# EAGLE design LB_BIT_i25_mp3Player-v03(3_3)OHW (EAGLE 6.6.0)

## Sheet 1 of 2: Main
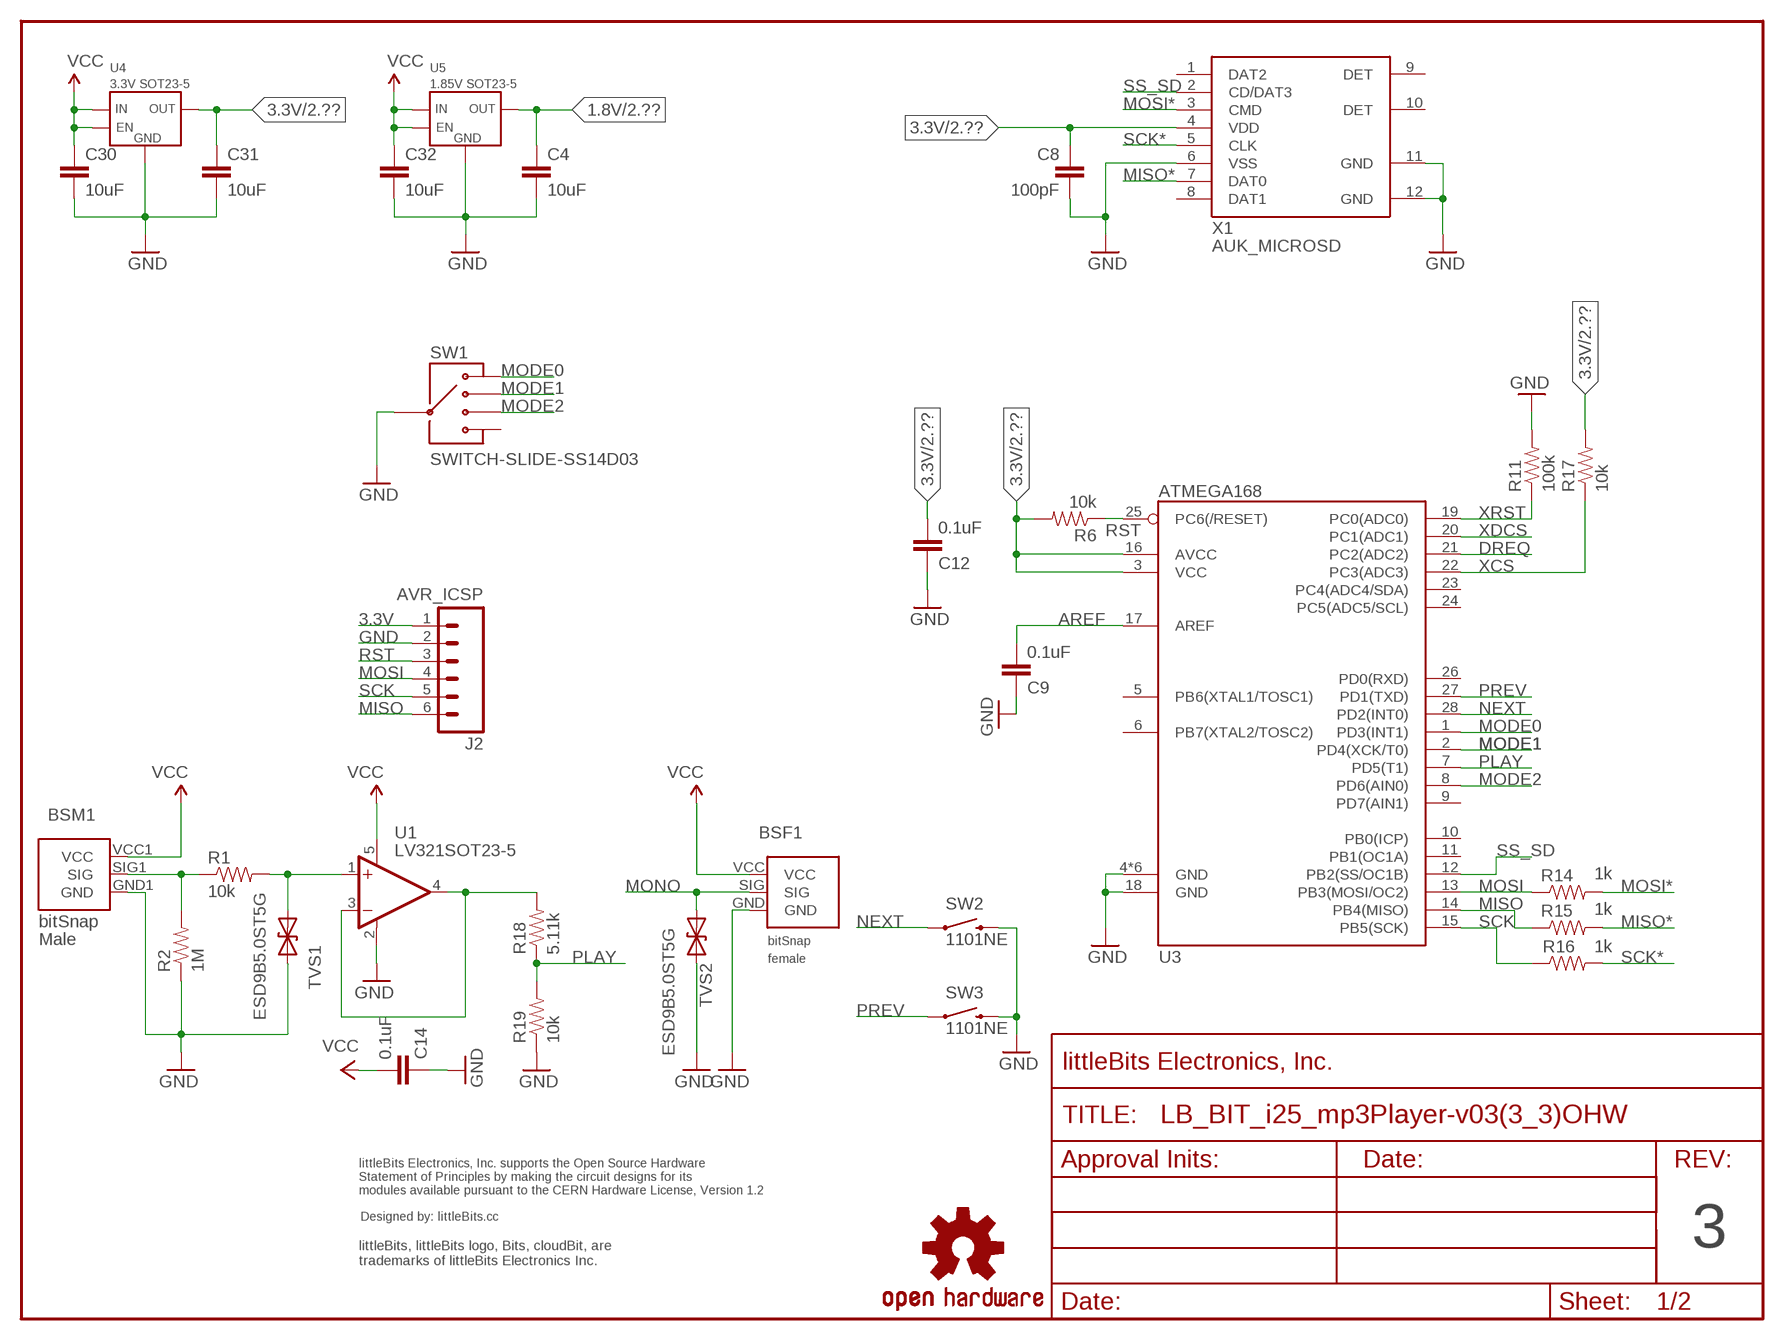
[diagram p0: schematic, sheet 1]

### Parts
BSF1  BITSNAP_V03_FEMALE  [BITSNAP_V03_FEMALE]
BSM1  BITSNAP_V03_MALE  [BITSNAP_V03_MALE]
C4  10uF  CAPCAP-0603  [CAP-0603]
C8  100pF  CAPCAP-0603  [CAP-0603]
C9  0.1uF  CAPCAP-0402  [CAP-0402]
C12  0.1uF  CAPCAP-0402  [CAP-0402]
C14  0.1uF  CAPCAP-0603  [CAP-0603]
C30  10uF  CAPCAP-0603  [CAP-0603]
C31  10uF  CAPCAP-0603  [CAP-0603]
C32  10uF  CAPCAP-0603  [CAP-0603]
J2  AVR_ICSP  HRD-60.1INCH_NO_SILKSCREEN_SMALL  [SIP6-SM-0.1IN-NOS.S-MIN]
R1  10k  RESISTOR0603  [RES-0603]
R2  1M  RESISTOR0603  [RES-0603]
R6  10k  RESISTOR0603  [RES-0603]
R11  100k  RESISTOR0603  [RES-0603]
R14  1k  RESISTOR0603  [RES-0603]
R15  1k  RESISTOR0603  [RES-0603]
R16  1k  RESISTOR0603  [RES-0603]
R17  10k  RESISTOR0603  [RES-0603]
R18  5.11k  RESISTOR0603  [RES-0603]
R19  10k  RESISTOR0603  [RES-0603]
SW1  SWITCH-SLIDE-SS14D03  [SWITCH-SLIDE-SP4T-SS14D03]
SW2  1101NE  SWITCH-MOMENTARY-2-SMD-1101NE  [TACTILE-SWITCH-1101NE]
SW3  1101NE  SWITCH-MOMENTARY-2-SMD-1101NE  [TACTILE-SWITCH-1101NE]
TVS1  ESD9B5.0ST5G  DIODE-TVSSOD-923  [SOD-923]
TVS2  ESD9B5.0ST5G  DIODE-TVSSOD-923  [SOD-923]
U1  LV321SOT23-5  [SOT23-5]
U3  ATMEGA168  ATMEGA168-28PINVFQFN-28  [VQFN28]
U4  3.3V SOT23-5  V_REG_SOT23-5_EN  [SOT23-5]
U5  1.85V SOT23-5  V_REG_SOT23-5_EN  [SOT23-5]
U$1  OSHWCREDIT  [OSHWCREDIT]
U$2  OSHW-LOGOL  [OSHW-LOGO-L]
U$38  FRAME-LETTER-OHWOHW  [FABDWG01-OHW]
X1  AUK_MICROSD  [AUK_TFC08WP01-R1K-H]

### Nets
1.8V: C4.1 U5.5(OUT) ; also sheet 2
3.3V: C8.1 C12.2 C31.1 J2.1 R6.2 R17.2 U3.3(VCC) U3.16(AVCC) U4.5(OUT) X1.4(VDD) ; also sheet 2
AREF: C9.2 U3.17(AREF)
DREQ: U3.21(PC2(ADC2)) ; also sheet 2
GND: BSF1.GND BSM1.GND1(GND) C4.2 C8.2 C9.1 C12.1 C14.1 C30.2 C31.2 C32.2 J2.2 R2.1 R11.2 R19.1 SW1.COM SW2.P$2 SW3.P$2 TVS1.2(C) TVS2.2(C) U1.2(V-) U3.4(GND) U3.18(GND) U3.TH(GND) U3.TH@1(GND) U3.TH@2(GND) U3.TH@3(GND) U3.TH@4(GND) U4.2(GND) U5.2(GND) X1.6(VSS) X1.11(GND) X1.12(GND) ; also sheet 2
MISO: J2.6 R15.1 U3.14(PB4(MISO))
MISO*: R15.2 X1.7(DAT0) ; also sheet 2
MODE0: SW1.1 U3.1(PD3(INT1))
MODE1: SW1.2 U3.2(PD4(XCK/T0))
MODE2: SW1.3 U3.8(PD6(AIN0))
MONO: BSF1.SIG TVS2.1(A) ; also sheet 2
MOSI: J2.4 R14.1 U3.13(PB3(MOSI/OC2))
MOSI*: R14.2 X1.3(CMD) ; also sheet 2
N$4: BSM1.SIG1(SIG) R1.1 R2.2
N$9: R1.2 TVS1.1(A) U1.1(+IN)
N$17: R18.2 U1.3(-IN) U1.4(OUT)
NEXT: SW2.P$1 U3.28(PD2(INT0))
PLAY: R18.1 R19.2 U3.7(PD5(T1))
PREV: SW3.P$1 U3.27(PD1(TXD))
RST: J2.3 R6.1 U3.25(PC6(/RESET))
SCK: J2.5 R16.1 U3.15(PB5(SCK))
SCK*: R16.2 X1.5(CLK) ; also sheet 2
SS_SD: U3.12(PB2(SS/OC1B)) X1.2(CD/DAT3)
VCC: BSF1.VCC BSM1.VCC1(VCC) C14.2 C30.1 C32.1 U1.5(V+) U4.1(IN) U4.3(EN) U5.1(IN) U5.3(EN) ; also sheet 2
XCS: R17.1 U3.22(PC3(ADC3)) ; also sheet 2
XDCS: U3.20(PC1(ADC1)) ; also sheet 2
XRST: R11.1 U3.19(PC0(ADC0)) ; also sheet 2
Unconnected: SW1.4 U3.5(PB6(XTAL1/TOSC1)) U3.6(PB7(XTAL2/TOSC2)) U3.9(PD7(AIN1)) U3.10(PB0(ICP)) U3.11(PB1(OC1A)) U3.23(PC4(ADC4/SDA)) U3.24(PC5(ADC5/SCL)) U3.26(PD0(RXD)) X1.1(DAT2) X1.8(DAT1) X1.9(DET) X1.10(DET)

### Notes on the sheet
- 3

## Sheet 2 of 2: Audio
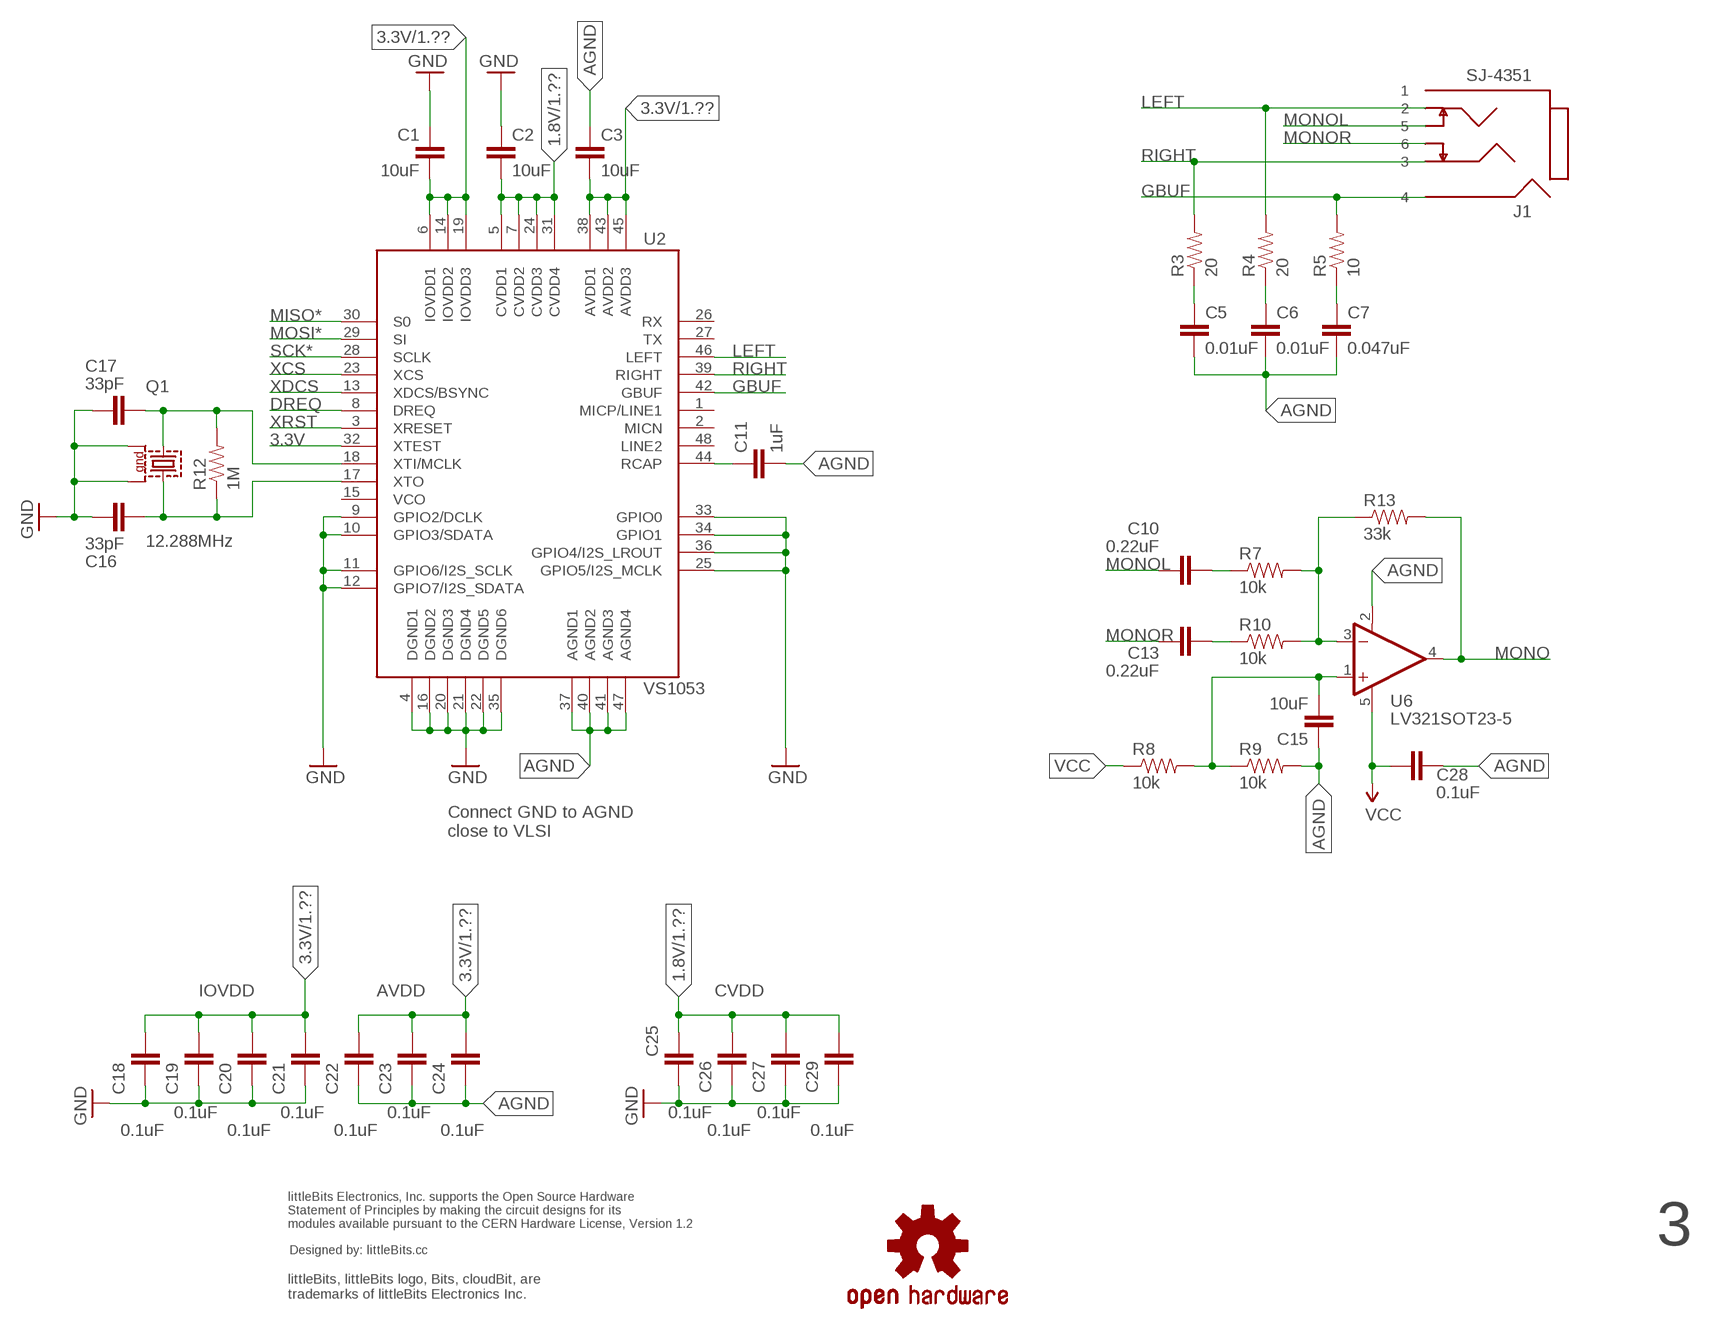
[diagram p1: schematic, sheet 2]

### Parts
C1  10uF  CAPCAP-0603  [CAP-0603]
C2  10uF  CAPCAP-0603  [CAP-0603]
C3  10uF  CAPCAP-0603  [CAP-0603]
C5  0.01uF  CAPCAP-0603  [CAP-0603]
C6  0.01uF  CAPCAP-0603  [CAP-0603]
C7  0.047uF  CAPCAP-0603  [CAP-0603]
C10  0.22uF  CAPCAP-0603  [CAP-0603]
C11  1uF  CAPCAP-0402  [CAP-0402]
C13  0.22uF  CAPCAP-0603  [CAP-0603]
C15  10uF  CAPCAP-0603  [CAP-0603]
C16  33pF  CAPCAP-0603  [CAP-0603]
C17  33pF  CAPCAP-0603  [CAP-0603]
C18  0.1uF  CAPCAP-0402  [CAP-0402]
C19  0.1uF  CAPCAP-0402  [CAP-0402]
C20  0.1uF  CAPCAP-0402  [CAP-0402]
C21  0.1uF  CAPCAP-0402  [CAP-0402]
C22  0.1uF  CAPCAP-0402  [CAP-0402]
C23  0.1uF  CAPCAP-0402  [CAP-0402]
C24  0.1uF  CAPCAP-0402  [CAP-0402]
C25  0.1uF  CAPCAP-0402  [CAP-0402]
C26  0.1uF  CAPCAP-0402  [CAP-0402]
C27  0.1uF  CAPCAP-0402  [CAP-0402]
C28  0.1uF  CAPCAP-0603  [CAP-0603]
C29  0.1uF  CAPCAP-0402  [CAP-0402]
J1  SJ-4351  JACK-PHONO-4COND-SW  [CUI-SJ-4351]
Q1  12.288MHz  CRYSTAL-SMD-7B-SERIES-TXC  [CRYSTAL-SMD-7B-SERIES-5X3.2MM]
R3  20  RESISTOR0603  [RES-0603]
R4  20  RESISTOR0603  [RES-0603]
R5  10  RESISTOR0603  [RES-0603]
R7  10k  RESISTOR0603  [RES-0603]
R8  10k  RESISTOR0603  [RES-0603]
R9  10k  RESISTOR0603  [RES-0603]
R10  10k  RESISTOR0603  [RES-0603]
R12  1M  RESISTOR0603  [RES-0603]
R13  33k  RESISTOR0603  [RES-0603]
U2  VS1053  [LQFP-48]
U6  LV321SOT23-5  [SOT23-5]
U$32  OSHWCREDIT  [OSHWCREDIT]
U$33  OSHW-LOGOL  [OSHW-LOGO-L]

### Nets
1.8V: C2.2 C25.1 C26.1 C27.1 C29.1 U2.5(CVDD1) U2.7(CVDD2) U2.24(CVDD3) U2.31(CVDD4) ; also sheet 1
3.3V: C1.2 C3.2 C18.1 C19.1 C20.1 C21.1 C22.1 C23.1 C24.1 U2.6(IOVDD1) U2.14(IOVDD2) U2.19(IOVDD3) U2.32(XTEST) U2.38(AVDD1) U2.43(AVDD2) U2.45(AVDD3) ; also sheet 1
AGND: C3.1 C5.2 C6.2 C7.2 C11.2 C15.1 C22.2 C23.2 C24.2 C28.1 R9.2 U2.37(AGND1) U2.40(AGND2) U2.41(AGND3) U2.47(AGND4) U6.2(V-)
DREQ: U2.8(DREQ) ; also sheet 1
GBUF: J1.4 R5.2 U2.42(GBUF)
GND: C1.1 C2.1 C16.2 C17.2 C18.2 C19.2 C20.2 C21.2 C25.2 C26.2 C27.2 C29.2 Q1.P$2 Q1.P$4 U2.4(DGND1) U2.9(GPIO2/DCLK) U2.10(GPIO3/SDATA) U2.11(GPIO6/I2S_SCLK) U2.12(GPIO7/I2S_SDATA) U2.16(DGND2) U2.20(DGND3) U2.21(DGND4) U2.22(DGND5) U2.25(GPIO5/I2S_MCLK) U2.33(GPIO0) U2.34(GPIO1) U2.35(DGND6) U2.36(GPIO4/I2S_LROUT) ; also sheet 1
LEFT: J1.2 R4.2 U2.46(LEFT)
MISO*: U2.30(S0) ; also sheet 1
MONO: R13.2 U6.4(OUT) ; also sheet 1
MONOL: C10.2 J1.5
MONOR: C13.2 J1.6
MOSI*: U2.29(SI) ; also sheet 1
N$1: R7.2 R10.2 R13.1 U6.3(-IN)
N$3: C6.1 R4.1
N$5: C5.1 R3.1
N$6: C7.1 R5.1
N$7: C10.1 R7.1
N$8: C13.1 R10.1
N$10: C16.1 Q1.P$3 R12.1 U2.17(XTO)
N$11: C11.1 U2.44(RCAP)
N$12: C17.1 Q1.P$1 R12.2 U2.18(XTI/MCLK)
RIGHT: J1.3 R3.2 U2.39(RIGHT)
SCK*: U2.28(SCLK) ; also sheet 1
VCC: C28.2 R8.1 U6.5(V+) ; also sheet 1
VREF: C15.2 R8.2 R9.1 U6.1(+IN)
XCS: U2.23(XCS) ; also sheet 1
XDCS: U2.13(XDCS/BSYNC) ; also sheet 1
XRST: U2.3(XRESET) ; also sheet 1
Unconnected: J1.1 U2.1(MICP/LINE1) U2.2(MICN) U2.15(VCO) U2.26(RX) U2.27(TX) U2.48(LINE2)

### Notes on the sheet
- Connect GND to AGND
  close to VLSI
- IOVDD | AVDD | CVDD
- 3

## Library data of the parts
BSF1 = bitSnap:BITSNAP_V03_FEMALE
BSM1 = bitSnap:BITSNAP_V03_MALE
C1-C32 = LITTLEBITS:CAP
J1 = LITTLEBITS:JACK-PHONO-4COND-SW
J2 = LITTLEBITS:HRD-6
Q1 = LITTLEBITS:CRYSTAL-SMD-7B-SERIES-TXC; MFG: TXC; MPN: 7B SERIES
R1-R19 = LITTLEBITS:RESISTOR
SW1 = LITTLEBITS:SWITCH-SLIDE-SS14D03: Vimex International Corp. MPN: SS-14D03 SP4T slide switch; MFG: Vimex; MPN: SS-14D03
SW2 SW3 = LITTLEBITS:SWITCH-MOMENTARY-2
TVS1 TVS2 = LITTLEBITS:DIODE-TVS: Bidirectional Transient Voltage Suppression Diode: Device conducts in avalanche mode after reaching a part dependent voltage threshold. Used for limiting voltage spikes on ESD sensitive inputs and outputs.; IEC_ESD_PROT0: +/-18kV; LB_PN: ?; MPN: ESD9B5.0ST5G; V_CLAMP: ?; V_OPERATION: 5V
U1 U6 = LITTLEBITS:LV321
U2 = LITTLEBITS:VS1053
U3 = LITTLEBITS:ATMEGA168-28PIN
U4 U5 = LITTLEBITS:V_REG_SOT23-5_EN: Generic device for a SOT23-5 surface mount LDO voltage regulator
U$1 U$32 = LITTLEBITS:OSHWCREDIT
U$2 U$33 = LITTLEBITS:OSHW-LOGO: Open Source Hardware Logo This logo indicates the piece of hardware it is found on incorporates a OSHW license and/or adheres to the definition of open source hardware found here: http://freedomdefined.org/OSHW
U$38 = LITTLEBITS:FRAME-LETTER-OHW
X1 = LITTLEBITS:AUK_MICROSD: AUK TFC08WP01-R1K-H Micro SD Card Slot.

## Net classes
1 power: width 0.61 mm, drill 0.711 mm, clearance 0.203 mm
3 usbvcc: width 0.508 mm, drill 0.711 mm, clearance 0.203 mm

## Board
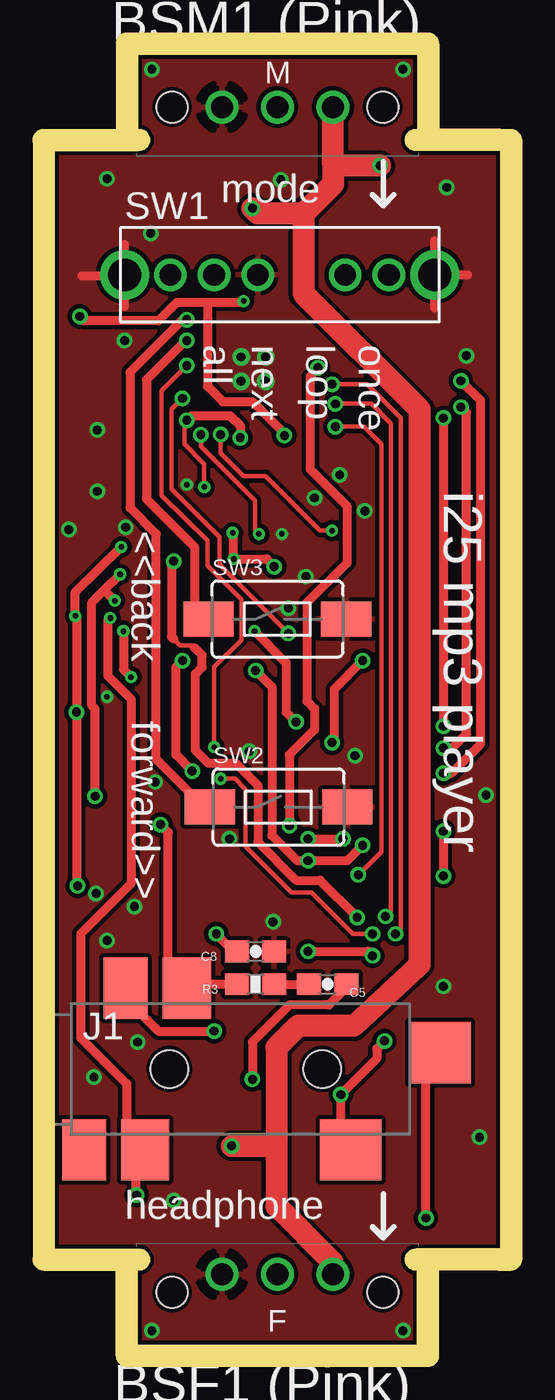
[diagram p2: board, top side]
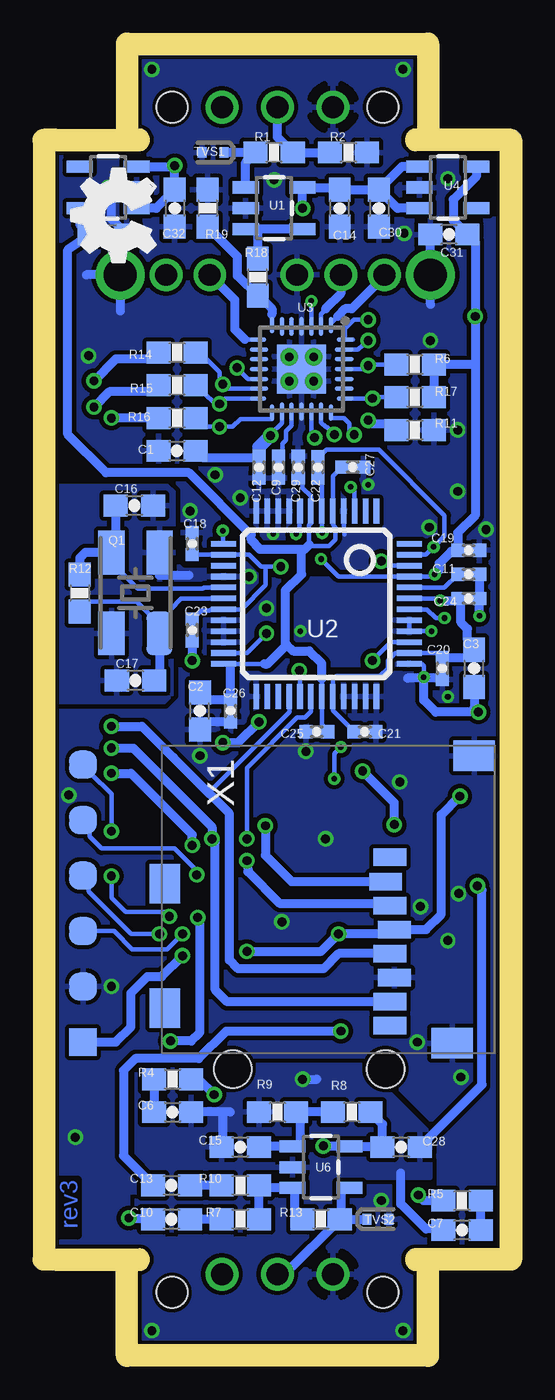
[diagram p3: board, bottom side, seen from below]

Size 20.4 x 59.02 mm. Coordinates in mm from the lower left corner, seen from the top.
Outline: 0,4.4 0,54.62
Outline: 20.4,54.62 20.4,4.4
Copper layers (1*16): Top 0.035mm / dielectric 1.5mm / Bottom 0.035mm
Design rules "littleBitsDRC": minimum track width 0.2mm, minimum drill 0.4mm, track to track 0.2mm, track to pad 0.2mm, pad to pad 0.2mm, via to via 0.2mm, smd to smd 0mil, copper to edge 0.2mm, drill to drill 0.2mm, minimum pad ring 0.2mm, minimum via ring 0.15mm, stop-mask expansion 0.1mm, vias tented up to drill 0mil, thermal gap 0.2mm
bRestrict: 10 lines
Milling: 6 lines

### Footprints (pad centres in the part's own frame; a part is rotated, then mirrored left to right if it is on the bottom)
BITSNAP_V03_FEMALE = drill 1: GND 4.065,3.44; SIG 6.605,3.44; VCC 9.145,3.44 | hole 1.4: 1.785,2.61; 11.425,2.61
BITSNAP_V03_MALE = drill 1: GND1 9.145,2.61; SIG1 6.605,2.61; VCC1 4.065,2.61 | hole 1.4: 1.785,2.61; 11.425,2.61
CAP-0603 = smd 1.1 x 1: 1 -0.85,0; 2 0.85,0
CAP-0402 = smd 0.6 x 0.6: 1 -0.5,0; 2 0.5,0
CUI-SJ-4351 = smd 2 x 2.8: 1 0.6,-3.7; 6 2.5,3.7 | smd 2.8 x 2.8: 2 12.8,-3.7; 5 16.9,0.75 | smd 2.2 x 2.8: 3 5.3,3.7; 4 3.4,-3.7 | hole 1.7: 4.5,0; 11.5,0
SIP6-SM-0.1IN-NOS.S-MIN = smd 1.27 x 1.27: 1 -6.35,0; 2 -3.81,0; 3 -1.27,0; 4 1.27,0; 5 3.81,0; 6 6.35,0
CRYSTAL-SMD-7B-SERIES-5X3.2MM = smd 2 x 1.2: P$1 -1.85,-1.1; P$2 1.85,-1.1; P$3 1.85,1.1; P$4 -1.85,1.1
RES-0603 = smd 1.1 x 1: 1 -0.85,0; 2 0.85,0
SWITCH-SLIDE-SP4T-SS14D03 = drill 1: 1 2.1,0; 2 4.1,0; 3 10.1,0; 4 12.1,0; COM 6.1,0 | drill 1.5: TH$1 0,0; TH$2 14.2,0
TACTILE-SWITCH-1101NE = smd 2.3 x 1.6: P$1 -3.15,0; P$2 3.15,0
SOD-923 = smd 0.4 x 0.5: 1 -0.5,0; 2 0.5,0
SOT23-5 = smd 0.55 x 1.2: 1 -0.95,-1.3; 2 0,-1.3; 3 0.95,-1.3; 4 0.95,1.3; 5 -0.95,1.3
LQFP-48 = smd 0.254 x 1.143: 1 -2.75,-4.25; 2 -2.25,-4.25; 3 -1.75,-4.25; 4 -1.25,-4.25; 5 -0.75,-4.25; 6 -0.25,-4.25; 7 0.25,-4.25; 8 0.75,-4.25; 9 1.25,-4.25; 10 1.75,-4.25; 11 2.25,-4.25; 12 2.75,-4.25; 25 2.75,4.25; 26 2.25,4.25; 27 1.75,4.25; 28 1.25,4.25; 29 0.75,4.25; 30 0.25,4.25; 31 -0.25,4.25; 32 -0.75,4.25; 33 -1.25,4.25; 34 -1.75,4.25; 35 -2.25,4.25; 36 -2.75,4.25 | smd 1.143 x 0.254: 13 4.25,-2.75; 14 4.25,-2.25; 15 4.25,-1.75; 16 4.25,-1.25; 17 4.25,-0.75; 18 4.25,-0.25; 19 4.25,0.25; 20 4.25,0.75; 21 4.25,1.25; 22 4.25,1.75; 23 4.25,2.25; 24 4.25,2.75; 37 -4.25,2.75; 38 -4.25,2.25; 39 -4.25,1.75; 40 -4.25,1.25; 41 -4.25,0.75; 42 -4.25,0.25; 43 -4.25,-0.25; 44 -4.25,-0.75; 45 -4.25,-1.25; 46 -4.25,-1.75; 47 -4.25,-2.25; 48 -4.25,-2.75
VQFN28 = smd 0.75 x 0.2: 1 -2,1.35; 7 -2,-1.35; 15 2,-1.35; 21 2,1.35 | smd 0.85 x 0.2: 2 -1.95,0.9; 3 -1.95,0.455; 4 -1.95,0; 5 -1.95,-0.45; 6 -1.95,-0.9; 16 1.95,-0.9; 17 1.95,-0.45; 18 1.95,0; 19 1.95,0.45; 20 1.95,0.9 | smd 0.2 x 0.75: 8 -1.35,-2; 14 1.35,-2; 22 1.35,2; 28 -1.35,2 | smd 0.2 x 0.85: 9 -0.9,-1.95; 10 -0.45,-1.95; 11 0,-1.95; 12 0.45,-1.95; 13 0.9,-1.95; 23 0.9,1.95; 24 0.45,1.95; 25 0,1.95; 26 -0.45,1.95; 27 -0.9,1.95 | smd 2.25 x 2.25: TH 0,0 | drill 0.406 pad 0.406: TH@1 -0.559,0.559; TH@2 0.559,0.559; TH@3 -0.559,-0.559; TH@4 0.559,-0.559
AUK_TFC08WP01-R1K-H = smd 0.8 x 1.5: 1 -1.2,10.3; 2 -0.1,10.1; 3 1,10.3; 4 2.1,10.5; 5 3.2,10.3; 6 4.3,10.5; 7 5.4,10.3; 8 6.5,10.3 | smd 1.8 x 1.4: 9 0,0; 10 5.7,0 | smd 1.4 x 1.9: 11 -5.85,14.15; 12 7.3,13.15

### Placement (x,y rotation side)
BSF1  3.59,-0.21 0 top
BSM1  16.8,59.23 180 top
C1  14.8,40.9 0 bottom
C2  13.75,29 90 bottom
C3  1.2,30.95 90 bottom
C4  17.95,50.8 0 bottom
C5  12.5,16.5 0 top
C6  15,10.65 0 bottom
C7  1.75,5.25 180 bottom
C8  9.2,18 0 top
C9  10.15,40.15 90 bottom
C10  15.05,5.75 180 bottom
C11  1.45,35.25 0 bottom
C12  11.05,40.15 90 bottom
C13  15.05,7.3 180 bottom
C14  7.35,52 90 bottom
C15  11.9,9.05 0 bottom
C16  16.75,38.4 0 bottom
C17  16.7,30.4 180 bottom
C18  14.1,36.65 90 bottom
C19  1.45,36.35 0 bottom
C20  2.65,30.95 270 bottom
C21  6.2,28.05 0 bottom
C22  8.35,40.14 90 bottom
C23  14.1,32.7 270 bottom
C24  1.45,34.15 0 bottom
C25  8.4,28.05 180 bottom
C26  12.35,29 270 bottom
C27  6.75,40.15 0 bottom
C28  4.54,9.05 180 bottom
C29  9.25,40.15 90 bottom
C30  5.55,52 270 bottom
C31  2.35,50.8 180 bottom
C32  14.9,52 270 bottom
DRILEGEND  [DRILEGEND]  49.48,-4.87 0 top  (outside the outline)
J1  0.75,12.62 0 top
J2  19.1,20.2 90 bottom
Q1  16.7,34.4 90 bottom
R1  10.35,54.55 180 bottom
R2  6.95,54.55 180 bottom
R3  9.2,16.5 180 top
R4  15,12.15 0 bottom
R5  1.75,6.6 180 bottom
R6  3.9,44.85 0 bottom
R7  11.9,5.75 0 bottom
R8  6.8,10.65 180 bottom
R9  10.2,10.65 180 bottom
R10  11.9,7.3 0 bottom
R11  3.9,41.85 0 bottom
R12  19.25,34.4 270 bottom
R13  8.2,5.75 0 bottom
R14  14.8,45.4 180 bottom
R15  14.8,43.9 180 bottom
R16  14.8,42.4 180 bottom
R17  3.9,43.35 0 bottom
R18  11.1,48.85 90 bottom
R19  13.4,52 270 bottom
SW1  3.2,48.95 0 top
SW2  10.25,24.6 0 top
SW3  10.2,33.2 0 top
TVS1  13.15,54.55 180 bottom
TVS2  5.6,5.75 0 bottom
U1  10.35,52 270 bottom
U2  8.42,33.9 180 bottom
U3  9.1,44.64 270 bottom
U4  2.4,52.95 270 bottom
U5  17.95,52.95 90 bottom
U6  8.21,8.13 270 bottom
U$1  -63.6,-51.25 0 top  (outside the outline)
U$2  6.87,-57.97 0 top  (outside the outline)
U$19  [OSHW_FILLX150_NOTEXT]  15.81,48.71 0 top
U$32  -63.6,-51.25 0 top  (outside the outline)
U$33  6.87,-57.97 0 top  (outside the outline)
U$38  31,13.15 0 top  (outside the outline)
X1  15.35,21.1 270 bottom

### Tracks (layer width: path | path; a pad name or v marks a point on that pad's centre or on a via)
1.8V
  Bottom 0.203: 12.35,31.05 12.35,31.15 | 12.35,31.15 U2.24 | C27.1 7.67,39.73 U2.5 7.67,37.52 7.55,37.4 7.55,36.85 7.85,36.55 8.7,36.55 8.75,36.6 8.75,37.5 8.67,37.58 U2.7 8.67,38.82 9.05,39.2 9.05,39.45 C29.1 | 8.17,30.47 U2.31 8.17,28.37 7.9,28.1 C25.1 | 12.35,31.15 10.8,31.15
  Bottom 0.406: U5.5 19.25,51.25 C4.1 | C2.2 13.4,29.5 C26.1 12.35,31.05 | C4.1 18.8,50.7 18.85,50.7 | C4.1 19.8,50.1 19.8,41.65 18.05,39.9 14.25,39.9 11.4,37.05 11.4,36.85 11,36.4 9.1,36.4 | 8.17,30.47 8.17,31.17 8.75,31.75 9.5,31.75 9.77,32.02 | 10.8,31.15 10.65,31.15 9.77,32.02 | 9.77,32.02 9.85,32.1 9.85,34.5 9.1,35.25 9.1,36.4 | 9.1,36.4 8.95,36.4 8.75,36.6
3.3V  (via drill 0.25, 0.41)
  Top 0.406: v1.15,47.05 1.35,46.85 4.75,46.85 5.6,47.7 7,47.7 | 8.6,47.75 v8.65,47.75 8.6,47.7 7,47.7 | 7,47.7 7,43.85 7.7,43.15 9.05,43.15 10.52,41.69 v10.52,41.6 | C8.1 8.15,18 8.15,18.05 v7.4,18.8 | v1.85,25.1 1.85,29.1 1.7,29.25 1.7,33.95 2.27,34.52 | 2.27,34.52 v3,35.25 | v10.05,35.6 9.7,35.95 v8.2,35.95 8.2,37.1 v8.15,37.15 | v11.6,18 14.35,18 v14.55,17.8 | v2.75,34.05 2.27,34.52
  Bottom 0.203: C20.1 2.85,31.65 U2.38 4.8,31.65 5.15,31.3 5.15,30.95 5.5,30.6 7.5,30.6 7.65,30.45 7.65,29.67 U2.32 7.67,29.02 C21.1 | C18.1 U2.14 11.5,36.15 10.95,35.6 10.75,35.6 | C22.1 8.17,39.47 U2.6 8.17,37.22 v8.15,37.15 | C19.1 1.95,36.3 | v3,35.25 3.1,35.15 U2.45 7.4,35.15 v8.2,35.95 | 2.05,34.05 C24.1 U2.43 | C23.1 13.7,33.6 13.3,33.6 13.25,33.65 U2.19 11.85,33.65 10.75,34.75 10.75,35.6 | U3.3 8.64,47.55 v8.65,47.75 | 10.75,35.6 v10.05,35.6 | v10.52,41.6 10.52,41.66 10,42.18 U3.16
  Bottom 0.406: U4.5 1.1,53.45 2.15,52.4 2.15,51.45 C31.1 1.45,50.8 1.15,50.5 v1.15,47.05 1.15,44.85 | 1.15,44.85 R6.2 R17.2 | C20.1 1.55,31.45 C3.2 1.2,31.95 1.5,32.25 1.5,32.75 1.8,33.05 1.8,34 C24.1 | 1.15,44.85 1.15,37.95 1.95,37.15 C19.1 | v2.75,34.05 2.05,34.05 | C1.2 13.65,40.6 11.1,40.6 C12.2 | 1.95,36.3 2.25,36.3 2.8,35.75 2.8,35.45 v3,35.25 | J2.1 17.6,13.85 16.9,14.55 16.9,16.1 16.15,16.85 15.5,16.85 v14.55,17.8 | v11.6,18 8.2,18 v7.4,18.8 5.4,18.8 5.15,19.05 4.9,19.05 X1.4 3.4,19 2.7,19.7 2.7,24.25 v1.85,25.1
  Bottom 0.61: C12.2 11.05,41.07 v10.52,41.6
AGND  (via drill 0.25, 0.41)
  Top 0.406: v12.7,27.55 12.8,27.55 12.8,30 v14.1,31.3 | v11.05,28.5 10.6,28.95 10.6,31.2 v9.15,32.65 | v1.05,21 1,21.05 v1,28.95 1,33.35 v0.95,33.35 0.95,34.45 v3.05,36.5 | C5.2 13.35,16.35 12.55,15.55 10.75,15.55 9.05,13.85 v9.05,12.15 | v3.15,32.65 3.15,30.9 v3.5,30.55
  Bottom 0.203: v3.15,32.65 U2.40 U2.41 | C22.2 8.25,40.64 7.95,40.95 5.55,40.95 2.55,37.95 2.55,37 v3.05,36.5 3.4,36.15 U2.47 | U2.37 3.6,31.15 3.5,31.05 v3.5,30.55
  Bottom 0.406: C11.2 C24.2 v0.95,33.35 | 12.35,10.65 12.7,10.65 | 12.7,10.65 C6.2 | C7.2 2.65,5.3 3.4,5.3 4.55,6.45 4.55,7.85 | C3.1 1.2,29.15 v1,28.95 2.95,28.95 3.5,29.5 v3.5,30.55 | C23.2 v14.1,31.3 | v12.7,27.55 12,27.55 v11.05,28.5 | C15.1 12.7,9.05 12.7,10.65 | 3.6,9.05 C28.1 0.84,11.9 0.84,20.79 v1.05,21 | v9.05,12.15 8.4,12.15
  pour Bottom: 6.95,5.25 16.65,5.25 16.65,12.8 6.35,12.8 3.2,9.65 3.2,7.65 6.9,7.65 6.9,5.2
  pour Bottom: 4.15,35.15 4.15,31.1 9.7,31.1 9.7,35.05 6.85,35.05
AREF
  Bottom 0.203: 9.95,40.85 10.15,40.7 C9.2 9.96,40.87 9.96,41.24 9.8,41.4 9.8,41.8 9.55,42.05 U3.17
DREQ  (via drill 0.25, 0.41)
  Top 0.203: v9.35,37.1 9.17,37.28 9.17,38.63 6.7,41.1 v6.7,41.63 v6.69,41.64
  Bottom 0.203: U2.8 9.2,38.13 9.2,37.25 v9.35,37.1 | U3.21 7.75,42.4 7.15,42.4 6.9,42.15 6.9,41.85 v6.69,41.64
GBUF  (via drill 0.25, 0.41)
  Top 0.406: v3.75,6.85 3.7,6.95 3.7,8.47 J1.4 4.2,8.97 4.2,9.45 3.3,9.45 3.3,11.95 1.2,14.05 1.2,18.8 3.5,21.1 3.5,29.55 2.45,30.6 2.45,33.15 v2.55,33.25
  Bottom 0.203: U2.42 3.35,33.65 2.95,33.25 v2.55,33.25
  Bottom 0.406: R5.2 3.5,6.6 v3.75,6.85
GND  (via drill 0.25, 0.41)
  Top 0.406: 16.5,48.95 18.9,48.95 | 17.4,47.45 17.4,50.5 | 3.2,47.5 3.2,50.35 | 4.1,48.9 1.25,48.9
  Bottom 0.203: U2.4 7.15,37.68 7.14,37.06
  Bottom 0.406: v17.95,52.95 17.8,52.8 17.8,51.5 C4.2 17.4,50.5 17.4,47.3 | C26.2 13.4,28.5 C2.1 | 14.25,35.2 15.6,35.2 Q1.P$2 | 16.5,48.95 18.95,48.95 | 3.2,47.6 3.2,50.4 | 2.9,30.5 4.25,30.5
  other vias: 2.4,53.35 4.4,50.85 10.7,33.7 13.05,39.8 1.95,41.85 14.2,38.15 6.05,39.35 2.4,29.65 3.8,13.85 2.4,18.5 8.9,27.15 10,19.35 11.5,35.15 19.75,25.15 17.8,16.4 13.75,26.95 3.25,37.4 4.6,25.75 3.65,20.05 8,23.15 15.95,0.65 4.45,0.65 19.45,9.5 15.95,58.35 4.45,58.35 3.2,45.95 10.4,37.1 1.8,12.25 10.35,53.3 1.95,39.05 0.65,37.3 18.85,45.25 5.45,6.6 1.9,20.65 11.9,38.75
  pour Bottom (rank 6): -1,59.05 20.4,59.05 20.4,-0.08 -1,-0.08
  pour Top: 0.02,59.05 20.75,59.05 20.75,-0.18 0.02,-0.08
  pour Top (no thermals): 7.9,45.9 10.15,45.9 10.15,43.4 7.9,43.4
LEFT  (via drill 0.41)
  Top 0.203: 5.45,32.3 5.75,32 6.3,32 6.4,31.9
  Top 0.406: 13.57,8.92 J1.2 13.15,9.32 13.15,9.37 13.1,9.37 v13.1,11.45 14.75,13.1 14.75,13.55 v15.1,13.9 | v5.45,35.85 5.45,35.75 5.35,35.65 5.35,32.4 5.45,32.3 | 6.4,31.9 6.75,31.55 6.75,31 6.45,30.7 6.45,27.2 7.05,26.6 8.3,26.6 9.3,25.6 9.3,23 11.05,21.25 12.15,21.25 v13.85,19.55
  Bottom 0.203: U2.46 5.25,35.65 v5.45,35.85
  Bottom 0.406: R4.2 13.8,12.15 v13.1,11.45 | v15.1,13.9 14.15,13.9 13.75,14.3 13.75,19.45 v13.85,19.55
MISO  (via drill 0.41)
  Top 0.203: v12.85,43.05 14.5,43.05 15.4,42.15 15.4,19.85 v15.15,19.6
  Top 0.406: v17.8,23.5 v17.8,21.45
  Bottom 0.203: 13.75,43.9 R15.1 13.55,43.9 13.75,43.55 13.55,43.55 13.05,43.05 v12.85,43.05 12.61,43.29 U3.14 | 18.8,26.25 J2.6 18.75,26.2 18.75,26.15 17.8,25.2 v17.8,23.5 | v17.8,21.45 17.8,20.45 17.15,19.8 15.35,19.8 v15.15,19.6
MISO*  (via drill 0.41)
  Top 0.406: v11.6,23.15 v13.2,23.15 | v17.8,27.3 18.2,27.3 18.85,27.95 18.85,42.65 v18.6,42.9
  Bottom 0.203: U2.30 8.67,28.98 8.95,28.7 9.3,28.7 11.6,26.4 v11.6,23.15
  Bottom 0.406: R15.2 15.95,43.6 17.9,43.6 v18.6,42.9 | X1.7 12.5,15.7 13.05,16.25 13.05,23 v13.2,23.15 13.2,23.7 16.8,27.3 v17.8,27.3
MODE0
  Bottom 0.203: 7.45,47.05 7.75,46.75 U3.1
  Bottom 0.406: SW1.1 5.3,48.9 6.8,47.4 7.1,47.4 7.45,47.05
MODE1
  Bottom 0.203: 8,47.4 8,47.35 8.2,47.15 U3.2
  Bottom 0.406: SW1.2 7.3,48.1 8,47.4
MODE2
  Bottom 0.203: U3.8 11.69,45.99 11.7,46
  Bottom 0.406: SW1.3 12.15,47.8 12.15,46.45 11.7,46
MONO
  Bottom 0.406: R13.2 TVS2.1 | U6.4 7.3,7.18 7.3,5.8 R13.2 | BSF1.SIG 9.87,3.23 R13.2
MONOL  (via drill 0.41)
  Top 0.406: J1.5 17.65,12.8 | 17.65,12.8 17.65,12.65 18.1,12.2 | v17,5.8 17,12.15 17.65,12.8
  Bottom 0.406: v17,5.8 15.95,5.8 C10.2
MONOR  (via drill 0.41)
  Top 0.406: J1.6 3.25,15.65 3.45,15.65 4.75,14.35 v7.3,14.35
  Bottom 0.406: v7.3,14.35 12.55,14.35 13.8,13.1 16.7,13.1 17.25,12.55 17.25,8.65 C13.2
MOSI  (via drill 0.41)
  Top 0.203: v12.7,43.95 14.3,43.95 15.85,42.4 15.85,19.05 v15.6,18.8
  Bottom 0.203: 13.8,45.4 R14.1 13.75,45.4 12.85,44.5 12.85,44.1 v12.7,43.95 12.49,43.74 U3.13 | 18.85,21.52 J2.4 18.85,21.22 18.85,20.75 16.9,18.8 v15.6,18.8
MOSI*  (via drill 0.41)
  Top 0.406: v9.2,30.85 9.95,30.1 9.95,23.3 11.1,22.15 v11.6,22.15 13.4,22.15 v14.1,22.85 | v18.6,44.1 19.5,43.2 19.5,27.5 18.15,26.15 v17.8,26.15
  Bottom 0.203: U2.29 9.17,30.82 v9.2,30.85
  Bottom 0.406: R14.2 15.7,45.4 16,45.1 17.6,45.1 v18.6,44.1 | v17.8,26.15 16.9,26.15 14.1,23.35 v14.1,22.85 | v11.6,22.15 11.55,21.65 10.1,20.2 5.15,20.2 X1.3
N$1
  Bottom 0.406: R13.1 9.4,5.8 9.4,7.18 U6.3 10.83,7.18 R10.2 R7.2
N$3
  Bottom 0.406: R4.1 C6.1
N$4
  Bottom 0.406: BSM1.SIG1 10.21,55.26 R1.1 R2.2
N$5
  Top 0.406: R3.1 C5.1
N$6
  Bottom 0.406: C7.1 R5.1
N$7
  Bottom 0.406: R7.1 C10.1
N$8
  Bottom 0.406: R10.1 C13.1
N$9
  Bottom 0.406: TVS1.1 R1.2 11.65,54.1 U1.1
N$10
  Bottom 0.203: Q1.P$3 17.65,36.1 17.65,35.65 16.6,34.6 13.6,34.6 13.55,34.65 U2.17
  Bottom 0.406: R12.1 19.25,36 19,36.25 Q1.P$3 17.6,36.45 C16.1
N$11
  Bottom 0.203: U2.44 2.55,34.65 C11.1
N$12
  Bottom 0.203: R12.2 18.8,34 16.65,34 15.6,32.95 Q1.P$1 15.5,32.65 15.5,33.1 15.1,33.1 15.1,33.65 14.6,34.15 U2.18
  Bottom 0.406: Q1.P$1 15.6,30.65 C17.1
N$17
  Bottom 0.406: U1.4 11.1,51.05 | 11.1,51.05 U1.3 | R18.2 11.1,51.05
NEXT  (via drill 0.41)
  Top 0.406: SW2.P$1 6.65,24.6 6.65,24.8 4.65,26.8 4.65,37.1 3.45,38.3 3.45,44.5 5.85,46.9 v6.05,46.9
  Bottom 0.203: U3.28 6.86,45.99 | 6.75,45.99 U3.28 | v6.05,46.9 6.7,46.9 7.1,46.5 U3.28
PLAY
  Bottom 0.203: 10.45,47.15 U3.7
  Bottom 0.406: 10.45,47.15 10.45,47.4 11.05,48 R18.1 12,48.9 12.05,48.9 12.05,49.8 R19.2 13.15,51.15
PREV  (via drill 0.41)
  Top 0.203: v6.05,45.95 6,45.95
  Top 0.406: SW3.P$1 6.7,33.2 | SW3.P$1 6.8,33.45 6.5,33.45 6.15,33.8 | 6,45.95 4.2,44.15 4.2,38.7 6.4,36.5 6.4,33.2 SW3.P$1
  Bottom 0.203: U3.27 6.51,45.54 v6.05,45.95
RIGHT  (via drill 0.41)
  Top 0.406: R3.2 6.23,16.5 J1.3 5.2,17.17 5.2,23.45 v4.85,23.8 | v6.3,26.25 5.55,27 5.55,31 v5.85,31.3
  Bottom 0.203: U2.39 5,32.15 v5.85,31.3
  Bottom 0.406: v4.85,23.8 4.85,24.8 v6.3,26.25
RST  (via drill 0.25, 0.41)
  Top 0.203: v6.05,44.8 4.9,43.65 4.9,38.85 7,36.8 7,35.65 8.55,34.1 8.55,32.25 7.3,31 v7.3,27.35 | v7.6,25.9 8.25,25.9 8.75,25.4 8.75,22.8 10.85,20.7 11.75,20.7 13.65,18.8 v14.55,18.8
  Bottom 0.203: 4.96,44.64 R6.1 6,44.85 v6.05,44.8 6.21,44.64 U3.25 | J2.3 17.68,18.93 16.85,18.1 15.25,18.1 v14.55,18.8 | v7.6,25.9 7.6,27.05 v7.3,27.35
SCK  (via drill 0.41)
  Top 0.203: v12.85,42 14.15,42 14.95,41.2 14.95,22.55 v13.9,21.5
  Bottom 0.203: 13.5,42.1 13.8,42.4 R16.1 13.95,42 v12.85,42 12.25,42 11.9,42.35 10.45,42.35 U3.15 | v13.9,21.5 13.9,21.7 14.9,22.7 18.25,22.7 18.8,23.25 18.8,23.71 J2.5
SCK*  (via drill 0.41)
  Top 0.406: v17.8,42.4 v17.8,28.3
  Bottom 0.203: U2.28 9.65,29.63 9.65,28.95 13.32,25.28 13.3,25.25 14.1,26 | 14.95,26.85 14.98,26.88
  Bottom 0.406: R16.2 v17.8,42.4 | v17.8,28.3 16.4,28.3 14.98,26.88 14.1,26 12.4,24.3 12.4,17.6 12,17.2 8.1,17.2 7.4,17.9 X1.5
SS_SD  (via drill 0.41)
  Top 0.406: v10.75,23.75 10.75,27 11.9,28.15 11.9,29.1 11.55,29.45 11.55,33.95 13.4,35.8 13.4,38.35 11.7,40.05 11.7,44.3 v12.05,44.7
  Bottom 0.203: U3.12 11.54,44.19 v12.05,44.7
  Bottom 0.406: v10.75,23.75 10.75,22.4 9.55,21.2 X1.2
VCC  (via drill 0.41)
  Top 0.406: 12.8,53.95 12.75,54
  Top 1: 11.4,51.75 12.75,53.1 12.75,54 12.75,56.54 BSM1.VCC1 | 11.4,51.75 11.4,48.1 16.7,42.8 16.7,17.4 16.6,17.3 13.7,14.6 11.15,14.6 10.15,13.6 10.15,9.35 | v14.9,53.95 12.8,53.95 | 11.4,51.75 9.3,51.75 v9.05,52 | v8.1,9.1 9.9,9.1 10.15,9.35 | 10.15,9.35 10.15,6.35 12.7,3.8 12.7,3.27 BSF1.VCC
  Bottom 0.406: U1.5 7.45,52.95 C14.2 C30.1 | U4.3 4.7,52 C30.1 | U4.1 4.5,53.9 C30.1 | U5.1 15.75,52 C32.1 v14.9,53.95 14.95,53.9 U5.3 | v9.05,52 U1.5 | U1.5 | v8.1,9.1 8.13,9.08 U6.5 5.42,9.08 C28.2 5.39,10.09 R8.1
VREF
  Bottom 0.406: R8.2 R9.1 9.15,10.5 9.15,9.15 9.22,9.08 U6.1 11.02,9.08 C15.2
XCS  (via drill 0.41)
  Top 0.203: v10.7,32.55 7.55,35.7 7.55,36.95 5.35,39.15 5.35,42.8 v5.85,43.3
  Bottom 0.203: 4.81,43.29 R17.1 5.75,43.35 v5.85,43.3 6.11,43.29 U3.22 | U2.23 11.6,31.65 v10.7,32.55
XDCS  (via drill 0.25, 0.41)
  Top 0.203: v7.6,41.65 7.6,40.8 8.65,39.75 9.65,39.75 12.15,37.25 v12.7,37.25
  Bottom 0.203: v12.7,37.25 12.7,36.68 U2.13 | U3.20 8.2,42.19 7.99,41.98 7.93,41.98 v7.6,41.65
XRST  (via drill 0.25, 0.41)
  Top 0.203: v6.85,39.25 6.85,40.3 5.95,41.2 5.95,42.2 v6.05,42.3
  Top 0.406: v8.5,41.5 8.5,42.05 8.05,42.5 6.25,42.5 v6.05,42.3
  Bottom 0.203: 6.7,38.12 U2.3 6.67,39.07 v6.85,39.25 | U3.19 8.65,41.65 v8.5,41.5
  Bottom 0.406: 5,41.85 R11.1 5.05,42.15 5.9,42.15 v6.05,42.3

### Text on the board
Bottom: rev3
tPlace: mode | all | next | loop | once | i25 mp3 player | <<back | forward>> | headphone
tNames: BSM1 (Pink) | BSF1 (Pink)
Milling: 1MM ROUTER PATH
Reference: XXLARGE
dxf: 3 | MP3 Player Bit
DrillLegend: LAYER-STACK
DrillLegend_01-16: 01-16
DrillLegend_01-20: 01-20